# EAGLE design version1b (EAGLE 6.5.0)
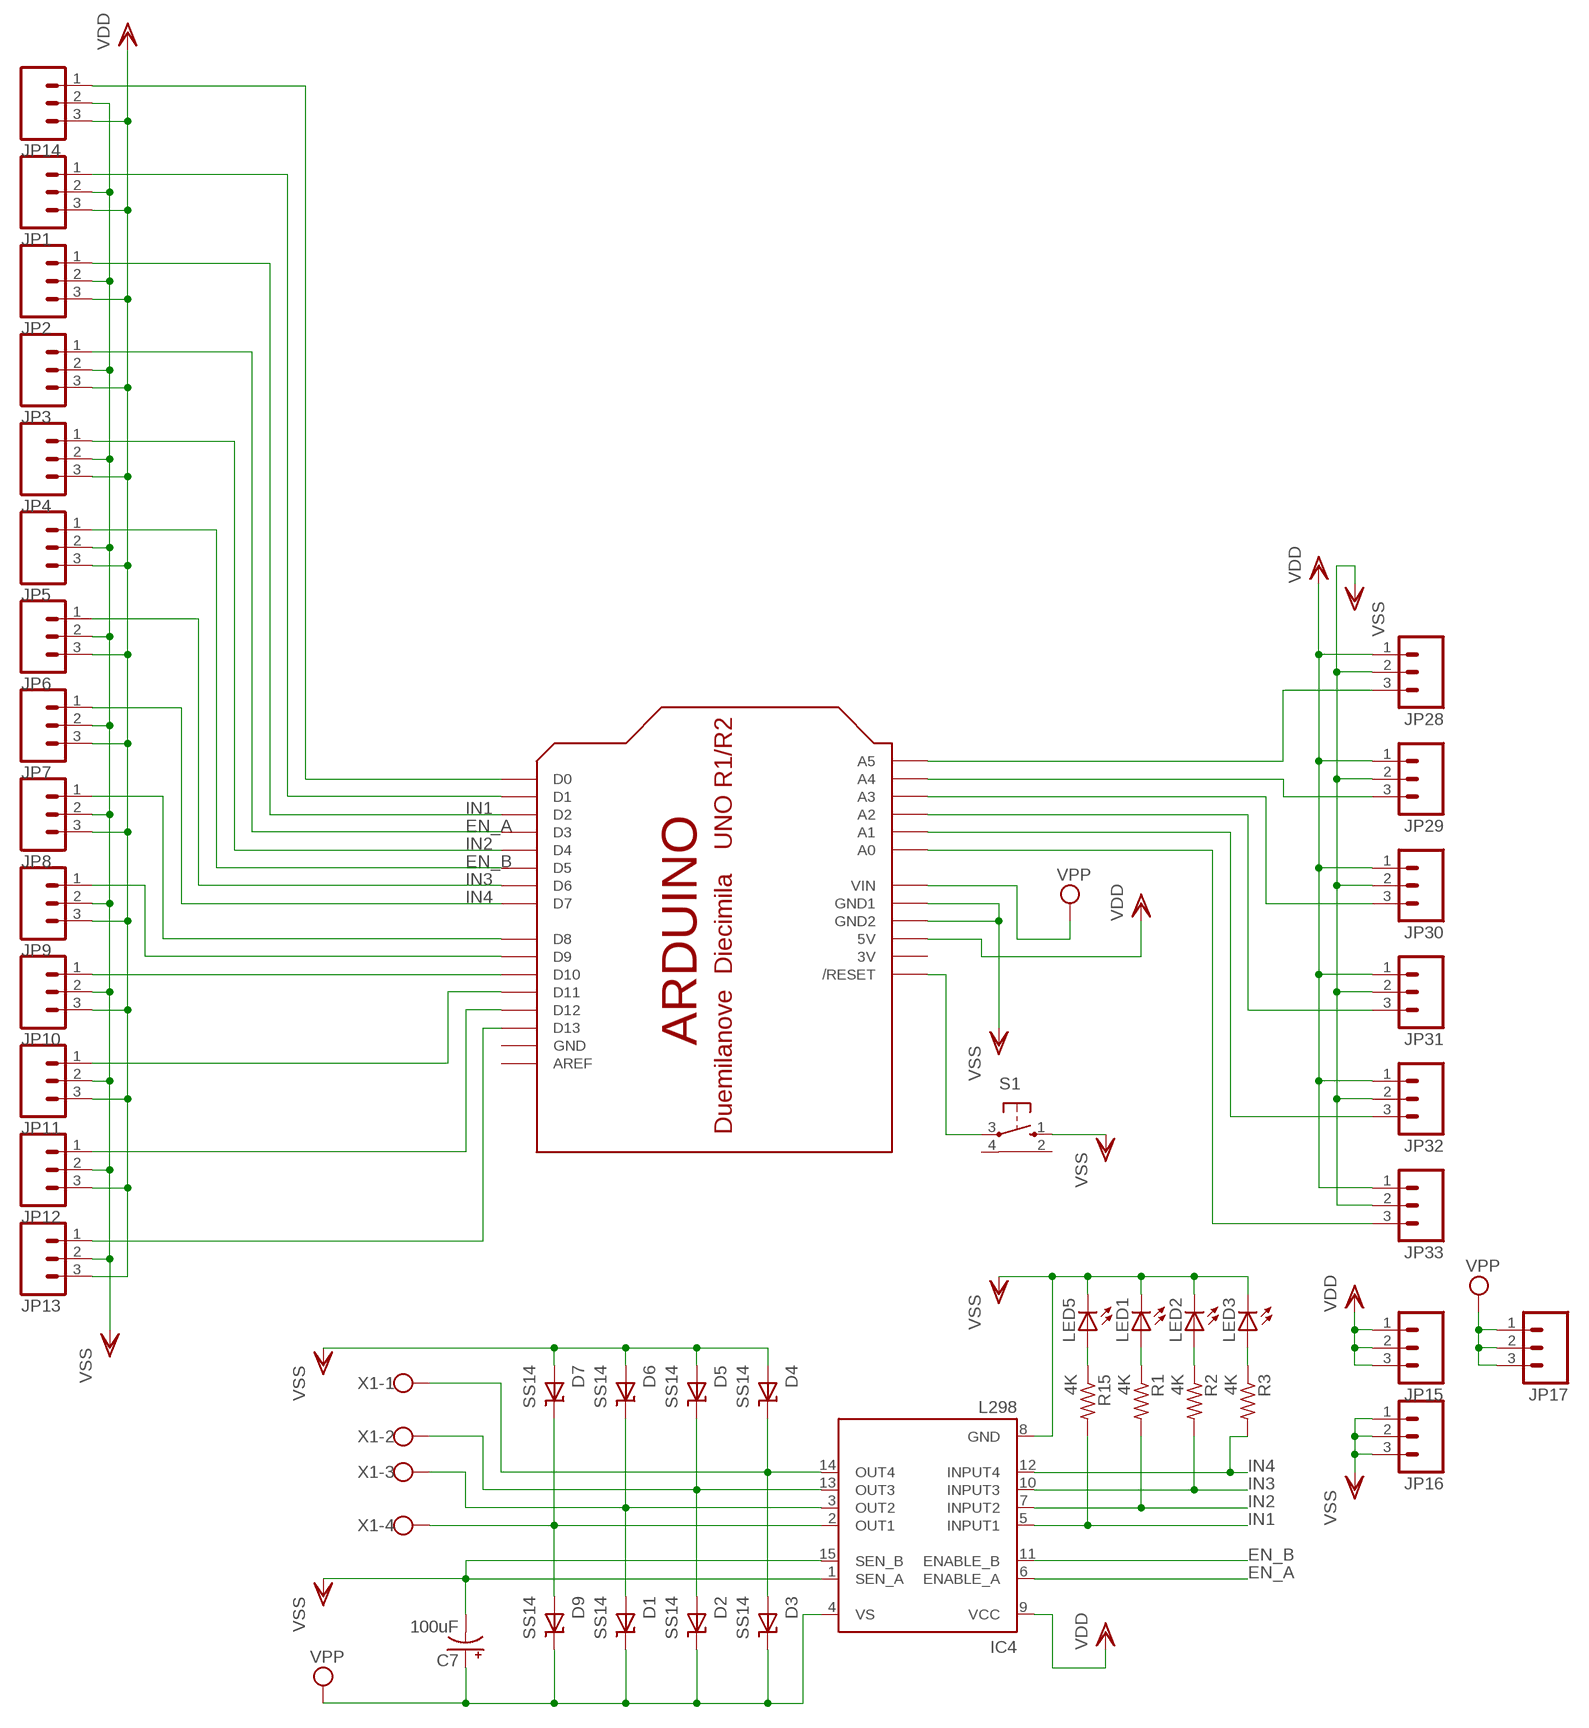
[diagram p0: schematic, sheet 1]

## Parts
C7  100uF  CPOL-US153CLV-0605  [153CLV-0605]
D1  SS14  [SMA]
D2  SS14  [SMA]
D3  SS14  [SMA]
D4  SS14  [SMA]
D5  SS14  [SMA]
D6  SS14  [SMA]
D7  SS14  [SMA]
D9  SS14  [SMA]
IC4  L298  [MULTIWATT-15]
JP1  M03PTH  [1X03]
JP2  M03PTH  [1X03]
JP3  M03PTH  [1X03]
JP4  M03PTH  [1X03]
JP5  M03PTH  [1X03]
JP6  M03PTH  [1X03]
JP7  M03PTH  [1X03]
JP8  M03PTH  [1X03]
JP9  M03PTH  [1X03]
JP10  M03PTH  [1X03]
JP11  M03PTH  [1X03]
JP12  M03PTH  [1X03]
JP13  M03PTH  [1X03]
JP14  M03PTH  [1X03]
JP15  M03PTH  [1X03]
JP16  M03PTH  [1X03]
JP17  M03PTH  [1X03]
JP28  M03PTH  [1X03]
JP29  M03PTH  [1X03]
JP30  M03PTH  [1X03]
JP31  M03PTH  [1X03]
JP32  M03PTH  [1X03]
JP33  M03PTH  [1X03]
LED1  LEDCHIP-LED0805  [CHIP-LED0805]
LED2  LEDCHIP-LED0805  [CHIP-LED0805]
LED3  LEDCHIP-LED0805  [CHIP-LED0805]
LED5  LEDCHIP-LED0805  [CHIP-LED0805]
R1  4K  R-US_R0805  [R0805]
R2  4K  R-US_R0805  [R0805]
R3  4K  R-US_R0805  [R0805]
R15  4K  R-US_R0805  [R0805]
S1  10-XX-RPAD  [B3F-10XX-RPAD]
U$1  ARDUINO-NOHOLE  [ARDUINO-NOHOLE]
X1  W237-4  [W237-4]

## Nets
EN_A: IC4.6(ENABLE_A) JP3.1 U$1.D3
EN_B: IC4.11(ENABLE_B) JP5.1 U$1.D5
IN1: IC4.5(INPUT1) JP2.1 R15.2 U$1.D2
IN2: IC4.7(INPUT2) JP4.1 R1.2 U$1.D4
IN3: IC4.10(INPUT3) JP6.1 R2.2 U$1.D6
IN4: IC4.12(INPUT4) JP7.1 R3.2 U$1.D7
N$1: JP13.1 U$1.D13
N$2: JP12.1 U$1.D12
N$3: JP28.3 U$1.A5
N$4: JP11.1 U$1.D11
N$5: JP10.1 U$1.D10
N$6: JP29.3 U$1.A4
N$7: JP9.1 U$1.D9
N$8: JP8.1 U$1.D8
N$9: JP30.3 U$1.A3
N$10: LED3.A R3.1
N$11: LED2.A R2.1
N$12: JP31.3 U$1.A2
N$13: LED1.A R1.1
N$14: LED5.A R15.1
N$16: JP33.3 U$1.A0
N$17: JP32.3 U$1.A1
N$19: JP1.1 U$1.D1
N$20: JP14.1 U$1.D0
N$22: S1.3(P) U$1.RESET(/RESET)
N$24: D7.P$1(K) D9.P$2(A) IC4.2(OUT1) X1.4
N$25: D1.P$2(A) D6.P$1(K) IC4.3(OUT2) X1.3
N$27: D2.P$2(A) D5.P$1(K) IC4.13(OUT3) X1.2
N$28: D3.P$2(A) D4.P$1(K) IC4.14(OUT4) X1.1
VDD: IC4.9(VCC) JP1.3 JP2.3 JP3.3 JP4.3 JP5.3 JP6.3 JP7.3 JP8.3 JP9.3 JP10.3 JP11.3 JP12.3 JP13.3 JP14.3 JP15.1 JP15.2 JP15.3 JP28.1 JP29.1 JP30.1 JP31.1 JP32.1 JP33.1 U$1.5V
VPP: C7.+ D1.P$1(K) D2.P$1(K) D3.P$1(K) D9.P$1(K) IC4.4(VS) JP17.1 JP17.2 JP17.3 U$1.VIN
VSS: C7.- D4.P$2(A) D5.P$2(A) D6.P$2(A) D7.P$2(A) IC4.1(SEN_A) IC4.8(GND) IC4.15(SEN_B) JP1.2 JP2.2 JP3.2 JP4.2 JP5.2 JP6.2 JP7.2 JP8.2 JP9.2 JP10.2 JP11.2 JP12.2 JP13.2 JP14.2 JP16.1 JP16.2 JP16.3 JP28.2 JP29.2 JP30.2 JP31.2 JP32.2 JP33.2 LED1.C LED2.C LED3.C LED5.C S1.1(S) U$1.GND1 U$1.GND2
Unconnected: S1.2(GND1) S1.4(GND2) U$1.AREF

## Power pins joined to a net without a drawn wire
3V: U$1.3V
GND: U$1.GND

## Library data of the parts
C7 = adafruit:CPOL-US: POLARIZED CAPACITOR, American symbol
D1-D7 D9 = SmartPrj:SS14: DIODE SS14 Diode Schottky 1A 40v
IC4 = st-microelectronics:L298: DUAL FULL-BRIDGE DRIVER; MPN: L298N; OC_FARNELL: 1589425; OC_NEWARK: 32M1527
JP1-JP17 JP28-JP33 = SparkFun:M03: Header 3 Standard 3-pin 0.1" header. Use with straight break away headers (SKU : PRT-00116), right angle break away headers (PRT-00553), swiss pins (PRT-00743), machine pins (PRT-00117), and female headers (PRT-00115). Molex polarized connector foot print use with SKU : PRT-08232 with associated crimp pins and housings.
LED1-LED3 LED5 = led:LED: LED OSRAM: - CHIPLED LG R971, LG N971, LY N971, LG Q971, LY Q971, LO R971, LY R971 LH N974, LH R974 LS Q976, LO Q976, LY Q976 LO Q996 - Hyper CHIPLED LW Q18S LB Q993, LB Q99A, LB R99A - SideLED LS A670, LO A670, LY A670, LG A670, LP A670 LB A673, LV A673, LT A673, LW A673 LH A674 LY A675 LS A676, LA A676, LO A676, LY A676, LW A676 LS A679, LY A679, LG A679 - Hyper Micro SIDELED® LS Y876, LA Y876, LO Y876, LY Y876 LT Y87S - SmartLED LW L88C, LW L88S LB L89C, LB L89S, LG L890 LS L89K, LO L89K, LY L89K LS L896, LA L896, LO L896, LY L896 - TOPLED LS T670, LO T670, LY T670, LG T670, LP T670 LSG T670, LSP T670, LSY T670, LOP T670, LYG T670 LG T671, LOG T671, LSG T671 LB T673, LV T673, LT T673, LW T673 LH T674 LS T676, LA T676, LO T676, LY T676, LB T676, LH T676, LSB T676, LW T676 LB T67C, LV T67C, LT T67C, LS T67K, LO T67K, LY T67K, LW E67C LS E67B, LA E67B, LO E67B, LY E67B, LB E67C, LV E67C, LT E67C LW T67C LS T679, LY T679, LG T679 LS T770, LO T770, LY T770, LG T770, LP T770 LB T773, LV T773, LT T773, LW T773 LH T774 LS E675, LA E675, LY E675, LS T675 LS T776, LA T776, LO T776, LY T776, LB T776 LHGB T686 LT T68C, LB T68C - Hyper Mini TOPLED® LB M676 - Mini TOPLED Santana® LG M470 LS M47K, LO M47K, LY M47K Source: http://www.osram.convergy.de LUXEON: - LUMILED® LXK2-PW12-R00, LXK2-PW12-S00, LXK2-PW14-U00, LXK2-PW14-V00 LXK2-PM12-R00, LXK2-PM12-S00, LXK2-PM14-U00 LXK2-PE12-Q00, LXK2-PE12-R00, LXK2-PE12-S00, LXK2-PE14-T00, LXK2-PE14-U00 LXK2-PB12-K00, LXK2-PB12-L00, LXK2-PB12-M00, LXK2-PB14-N00, LXK2-PB14-P00, LXK2-PB14-Q00 LXK2-PR12-L00, LXK2-PR12-M00, LXK2-PR14-Q00, LXK2-PR14-R00 LXK2-PD12-Q00, LXK2-PD12-R00, LXK2-PD12-S00 LXK2-PH12-R00, LXK2-PH12-S00 LXK2-PL12-P00, LXK2-PL12-Q00, LXK2-PL12-R00 Source: www.luxeon.com KINGBRIGHT: KA-3528ASYC Source: www.kingbright.com
R1-R3 R15 = adafruit:R-US_: RESISTOR, American symbol
S1 = repRapr:10-XX-RPAD: OMRON SWITCH
U$1 = adafruit:ARDUINO: Arduino Diecimila/Duemilanove Make a shield with ease, this package has all the named pins as well as the two mounting drill holes and an outline of the USB and DC power connector. The outline is on the DIMENSION layer, so if your board house uses it they will cut the outline to match. http://www.ladyada.net/library/pcb/eaglelibrary.html
X1 = con-wago-500:W237-4: WAGO SCREW CLAMP; OC_FARNELL: unknown; OC_NEWARK: unknown

## Board
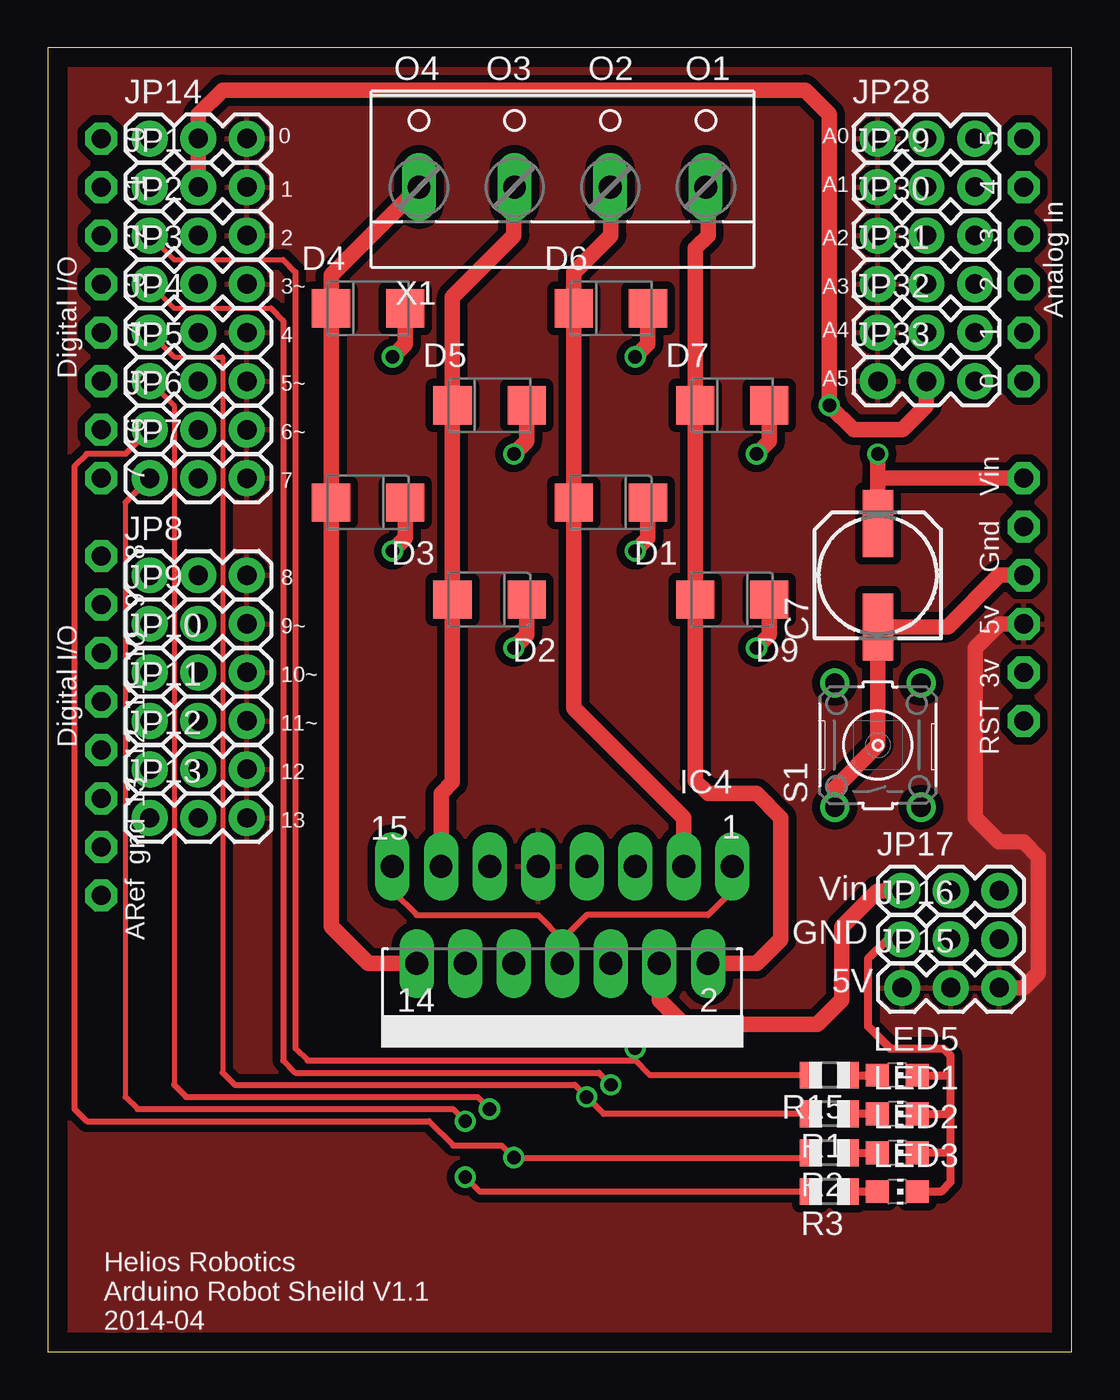
[diagram p1: board, top side]
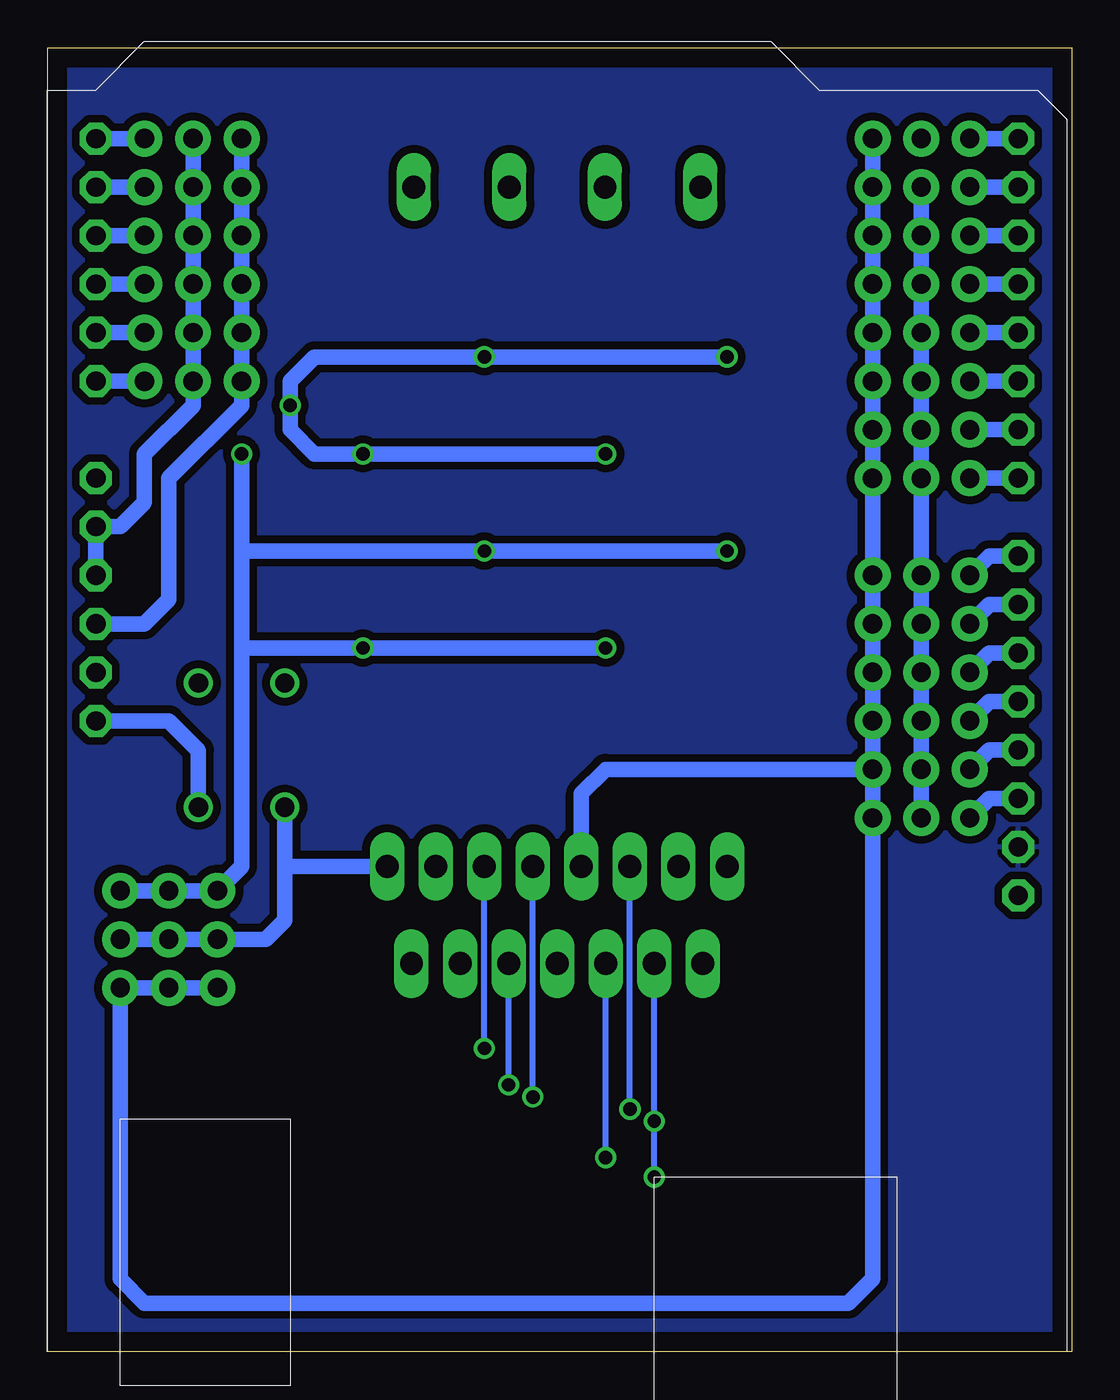
[diagram p2: board, bottom side, seen from below]

Size 53.57 x 68.25 mm. Coordinates in mm from the lower left corner, seen from the top.
Outline: 0,0 53.57,0 53.57,68.25 0,68.25 0,0
Copper layers (1*16): Top 0.035mm / dielectric 1.5mm / Bottom 0.035mm
Design rules "default": minimum track width 10mil, minimum drill 24mil, track to track 8mil, track to pad 8mil, pad to pad 8mil, via to via 8mil, smd to smd 8mil, copper to edge 40mil, drill to drill 8mil, minimum pad ring 10mil, minimum via ring 8mil, stop-mask expansion 4mil, vias tented up to drill 0mil, thermal gap 10mil

### Footprints (pad centres in the part's own frame; a part is rotated, then mirrored left to right if it is on the bottom)
153CLV-0605 = smd 3.5 x 1.6: + 2.7,0; - -2.7,0
SMA = smd 2 x 2: P$1 -1.94,0; P$2 1.94,0
MULTIWATT-15 = drill 1.2 long: 1 -8.89,-7.62; 2 -7.62,-2.54; 3 -6.35,-7.62; 4 -5.08,-2.54; 5 -3.81,-7.62; 6 -2.54,-2.54; 7 -1.27,-7.62; 8 0,-2.54; 9 1.27,-7.62; 10 2.54,-2.54; 11 3.81,-7.62; 12 5.08,-2.54; 13 6.35,-7.62; 14 7.62,-2.54; 15 8.89,-7.62
1X03 = drill 1.016 pad 1.88: 1 0,0; 2 2.54,0; 3 5.08,0
CHIP-LED0805 = smd 1.2 x 1.2: A 0,-1.05; C 0,1.05
R0805 = smd 1.1 x 1.4: 1 -1,0; 2 1,0
B3F-10XX-RPAD = drill 1.016: 1 -3.251,2.261; 2 3.251,2.261; 3 -3.251,-2.261; 4 3.251,-2.261
ARDUINO-NOHOLE = drill 1 pad 1.676 octagon: 3V 35.56,2.54; 5V 38.1,2.54; A0 50.8,2.54; A1 53.34,2.54; A2 55.88,2.54; A3 58.42,2.54; A4 60.96,2.54; A5 63.5,2.54; AREF 23.876,50.8; D0 63.5,50.8; D1 60.96,50.8; D2 58.42,50.8; D3 55.88,50.8; D4 53.34,50.8; D5 50.8,50.8; D6 48.26,50.8; D7 45.72,50.8; D8 41.656,50.8; D9 39.116,50.8; D10 36.576,50.8; D11 34.036,50.8; D12 31.496,50.8; D13 28.956,50.8; GND 26.416,50.8; GND1 43.18,2.54; GND2 40.64,2.54; RESET 33.02,2.54; VIN 45.72,2.54
W237-4 = drill 1.194 long: 1 -7.5,-1.27; 2 -2.5,-1.27; 3 2.5,-1.27; 4 7.5,-1.27

### Placement (x,y rotation side)
C7  43.43,40.64 90 top
D1  29.46,44.45 180 top
D2  23.11,39.37 180 top
D3  16.76,44.45 180 top
D4  16.76,54.61 0 top
D5  23.11,49.53 0 top
D6  29.46,54.61 0 top
D7  35.81,49.53 0 top
D9  35.81,39.37 180 top
IC4  26.92,17.78 180 top
JP1  5.33,60.96 0 top
JP2  5.33,58.42 0 top
JP3  5.33,55.88 0 top
JP4  5.33,53.34 0 top
JP5  5.33,50.8 0 top
JP6  5.33,48.26 0 top
JP7  5.33,45.72 0 top
JP8  5.33,40.64 0 top
JP9  5.33,38.1 0 top
JP10  5.33,35.56 0 top
JP11  5.33,33.02 0 top
JP12  5.33,30.48 0 top
JP13  5.33,27.94 0 top
JP14  5.33,63.5 0 top
JP15  44.7,19.05 0 top
JP16  44.7,21.59 0 top
JP17  44.7,24.13 0 top
JP28  43.43,63.5 0 top
JP29  43.43,60.96 0 top
JP30  43.43,58.42 0 top
JP31  43.43,55.88 0 top
JP32  43.43,53.34 0 top
JP33  43.43,50.8 0 top
LED1  44.45,12.45 270 top
LED2  44.45,10.41 270 top
LED3  44.45,8.38 270 top
LED5  44.45,14.48 270 top
R1  40.89,12.45 180 top
R2  40.89,10.41 180 top
R3  40.89,8.38 180 top
R15  40.89,14.48 180 top
S1  43.43,31.75 90 top
U$1  53.59,0 90 top
X1  26.92,62.23 0 top

### Tracks (layer width: path | path; a pad name or v marks a point on that pad's centre or on a via)
EN_A  (via drill 0.7)
  Top 0.254: JP3.1 6.6,54.61 11.68,54.61
  Top 0.305: 11.68,54.61 12.32,53.98 12.32,15.24 12.95,14.61 28.83,14.61 v29.46,13.97
  Bottom 0.305: v29.46,13.97 IC4.6
  Bottom 0.813: U$1.D3 JP3.1
EN_B  (via drill 0.7)
  Top 0.254: JP5.1 6.6,49.53 6.6,13.97
  Top 0.305: 6.6,13.97 7.24,13.34 22.48,13.34 v23.11,12.7
  Bottom 0.305: v23.11,12.7 IC4.11
  Bottom 0.813: U$1.D5 JP5.1
GND
  pour Bottom (isolate 0.406): 0,-0.25 0,67.69 53.59,67.94 53.59,0
IN1  (via drill 0.7)
  Top 0.254: JP2.1 6.6,57.15 12.32,57.15
  Top 0.305: 12.32,57.15 12.95,56.52 12.95,15.88 13.59,15.24 30.73,15.24 | 30.73,15.24 v30.73,15.88 | R15.2 31.5,14.48 30.73,15.24
  Bottom 0.305: v30.73,15.88 IC4.5
  Bottom 0.813: JP2.1 U$1.D2
IN2  (via drill 0.7)
  Top 0.254: JP4.1 6.6,52.07 9.14,52.07 9.14,14.61
  Top 0.305: 9.14,14.61 9.78,13.97 27.56,13.97 v28.19,13.34 29.08,12.45 R1.2
  Bottom 0.305: v28.19,13.34 IC4.7
  Bottom 0.813: JP4.1 U$1.D4
IN3  (via drill 0.7)
  Top 0.305: JP6.1 4.06,46.99 2.03,46.99 1.4,46.35 1.4,12.7 2.03,12.06 19.94,12.06 21.21,10.79 23.75,10.79 v24.38,10.16 39.64,10.16 R2.2
  Bottom 0.305: v24.38,10.16 IC4.10
  Bottom 0.813: JP6.1 U$1.D6
IN4  (via drill 0.7)
  Top 0.254: 4.06,44.45 4.06,13.34
  Top 0.305: JP7.1 4.06,44.45 | 4.06,13.34 4.7,12.7 21.21,12.7 v21.84,12.06 | R3.2 22.61,8.38 v21.84,9.14
  Bottom 0.305: IC4.12 v21.84,12.06 v21.84,9.14
  Bottom 0.813: U$1.D7 JP7.1
N$1
  Bottom 0.813: U$1.D13 4.32,28.96 JP13.1
N$2
  Bottom 0.813: U$1.D12 4.32,31.5 JP12.1
N$3
  Bottom 0.813: U$1.A5 JP28.3
N$4
  Bottom 0.813: U$1.D11 4.32,34.04 JP11.1
N$5
  Bottom 0.813: U$1.D10 4.32,36.58 JP10.1
N$6
  Bottom 0.813: JP29.3 U$1.A4
N$7
  Bottom 0.813: U$1.D9 4.32,39.12 JP9.1
N$8
  Bottom 0.813: U$1.D8 4.32,41.66 JP8.1
N$9
  Bottom 0.813: U$1.A3 JP30.3
N$10
  Top 0.406: LED3.A R3.1
N$11
  Top 0.406: R2.1 LED2.A
N$12
  Bottom 0.813: JP31.3 U$1.A2
N$13
  Top 0.406: LED1.A R1.1
N$14
  Top 0.406: R15.1 LED5.A
N$16
  Bottom 0.813: JP33.3 U$1.A0
N$17
  Bottom 0.813: U$1.A1 JP32.3
N$19
  Bottom 0.813: U$1.D1 JP1.1
N$20
  Bottom 0.813: JP14.1 U$1.D0
N$22
  Bottom 0.813: S1.3 45.7,31.47 47.24,33.02 U$1.RESET
N$24
  Top 0.813: X1.4 34.54,60.84 34.54,58.42 33.87,57.75 D7.P$1 D9.P$2 33.87,29.88 34.54,29.21 37.08,29.21 38.35,27.94 38.35,21.59 37.08,20.32 IC4.2
N$25
  Top 0.813: X1.3 29.46,60.92 29.46,58.42 27.52,56.48 D6.P$1 D1.P$2 27.52,33.69 33.27,27.94 IC4.3
N$27
  Top 0.813: X1.2 24.38,60.92 24.38,58.42 21.17,55.21 D5.P$1 D2.P$2 21.17,29.81 20.57,29.21 IC4.13
N$28
  Top 0.813: X1.1 14.82,56.36 D4.P$1 D3.P$2 14.82,22.26 16.76,20.32 IC4.14
VDD
  Top 0.813: U$1.5V 49.78,38.1 48.51,36.83 48.51,27.94 49.78,26.67 51.05,26.67 51.82,25.91 51.82,19.81 51.05,19.05 JP15.3
  Bottom 0.813: JP12.3 JP11.3 JP10.3 JP9.3 JP8.3 JP7.3 JP6.3 JP5.3 JP4.3 JP3.3 JP2.3 JP1.3 JP14.3 | JP12.3 JP13.3 10.41,3.81 11.68,2.54 48.51,2.54 49.78,3.81 JP15.3 JP15.2 JP15.1 | JP28.1 JP29.1 JP30.1 JP31.1 JP32.1 JP33.1 43.43,49.53 47.24,45.72 47.24,39.37 48.51,38.1 U$1.5V | IC4.9 25.65,29.21 24.38,30.48 JP12.3
  pour Top (isolate 0.406): 0,-0.25 0,67.69 53.59,67.94 53.59,0
VPP  (via drill 0.7)
  Top 0.813: U$1.VIN 43.43,45.72 | C7.+ 43.43,45.72 | v43.43,46.99 43.43,45.72 | D3.P$1 18.7,42.58 v18.03,41.91 | D1.P$1 31.4,42.58 v30.73,41.91 | D9.P$1 37.75,37.5 v37.08,36.83 | D2.P$1 25.05,37.5 v24.38,36.83 | IC4.4 32,18.41 33.27,17.14 40.26,17.14 41.53,18.41 41.53,22.23 43.43,24.13 JP17.1
  Bottom 0.813: 43.43,36.83 43.43,25.4 JP17.1 JP17.2 JP17.3 | 43.43,36.83 43.43,41.91 | 43.43,41.91 v43.43,46.99 | v18.03,41.91 v30.73,41.91 43.43,41.91 | v24.38,36.83 v37.08,36.83 43.43,36.83
VSS  (via drill 0.7)
  Top 0.305: IC4.15 18.03,24.13 19.3,22.86 25.65,22.86 26.92,21.59 | 26.92,21.59 IC4.8 | IC4.1 35.81,24.13 34.54,22.86 28.19,22.86 26.92,21.59
  Top 0.406: 47.24,10.67 47.24,8.89 46.74,8.38 LED3.C | 47.24,10.67 47.24,12.7 | 47.24,12.7 47.24,14.61 | 47.24,14.61 47.24,15.49 46.86,15.88 44.07,15.88 42.93,17.02 42.93,20.57 43.94,21.59 JP16.1 | LED5.C 47.12,14.48 47.24,14.61 | LED1.C 46.99,12.45 47.24,12.7 | 47.24,10.67 46.99,10.41 LED2.C
  Top 0.813: S1.1 41.17,29.49 43.43,31.75 C7.- 47.08,37.94 49.78,40.64 U$1.GND2 | D4.P$2 18.7,52.74 v18.03,52.07 | D5.P$2 25.05,47.66 v24.38,46.99 | D6.P$2 31.4,52.74 v30.73,52.07 | D7.P$2 37.75,47.66 v37.08,46.99 | JP33.2 45.97,49.53 44.7,48.26 42.16,48.26 v40.89,49.53 40.89,64.77 39.62,66.04 9.14,66.04 7.87,64.77 JP14.2 JP1.2
  Bottom 0.813: JP13.2 JP12.2 JP11.2 JP10.2 JP9.2 JP8.2 JP7.2 JP6.2 JP5.2 JP4.2 JP3.2 JP2.2 JP1.2 | JP28.2 JP29.2 JP30.2 JP31.2 JP32.2 JP33.2 45.97,49.53 48.51,46.99 48.51,44.45 49.78,43.18 U$1.GND1 U$1.GND2 | S1.1 41.17,25.4 | 41.17,25.4 41.17,22.58 42.16,21.59 JP16.1 JP16.2 JP16.3 | v18.03,52.07 v30.73,52.07 39.62,52.07 40.89,50.8 v40.89,49.53 40.89,48.26 39.62,46.99 v37.08,46.99 v24.38,46.99 | IC4.1 41.17,25.4

### Text on the board
BD-Top: RESET | IN1 | IN2 | IN3 | IN4 | DIRECTION
_tsilk: O4 | O3 | O2 | O1 | 0 | A0 | A1 | 1 | 2 | A2 | 3~ | A3 | 4 | A4 | A5 | 5~ | 6~ | 7 | 8 | 9~ | 10~ | 11~ | 12 | 13 | Vin | GND | 5V | Helios Robotics / Arduino Robot Sheild V1.1 / 2014-04